# Altium project SAMA7D65-Curiosity.PrjPcb (part 8 of 12)

## Sheet 11 - GMAC1-SODIMM.SchDoc
size B; CompanyName: Microchip Technology Inc.; Organization: Microchip Technology; Address1: 2355 West Chandler Blvd.; Address2: Chandler, AZ  85224; Address4: USA; DocumentNumber: 11; SheetNumber: 11; SheetTotal: 15; SheetTitle: GMAC1 SODIMM
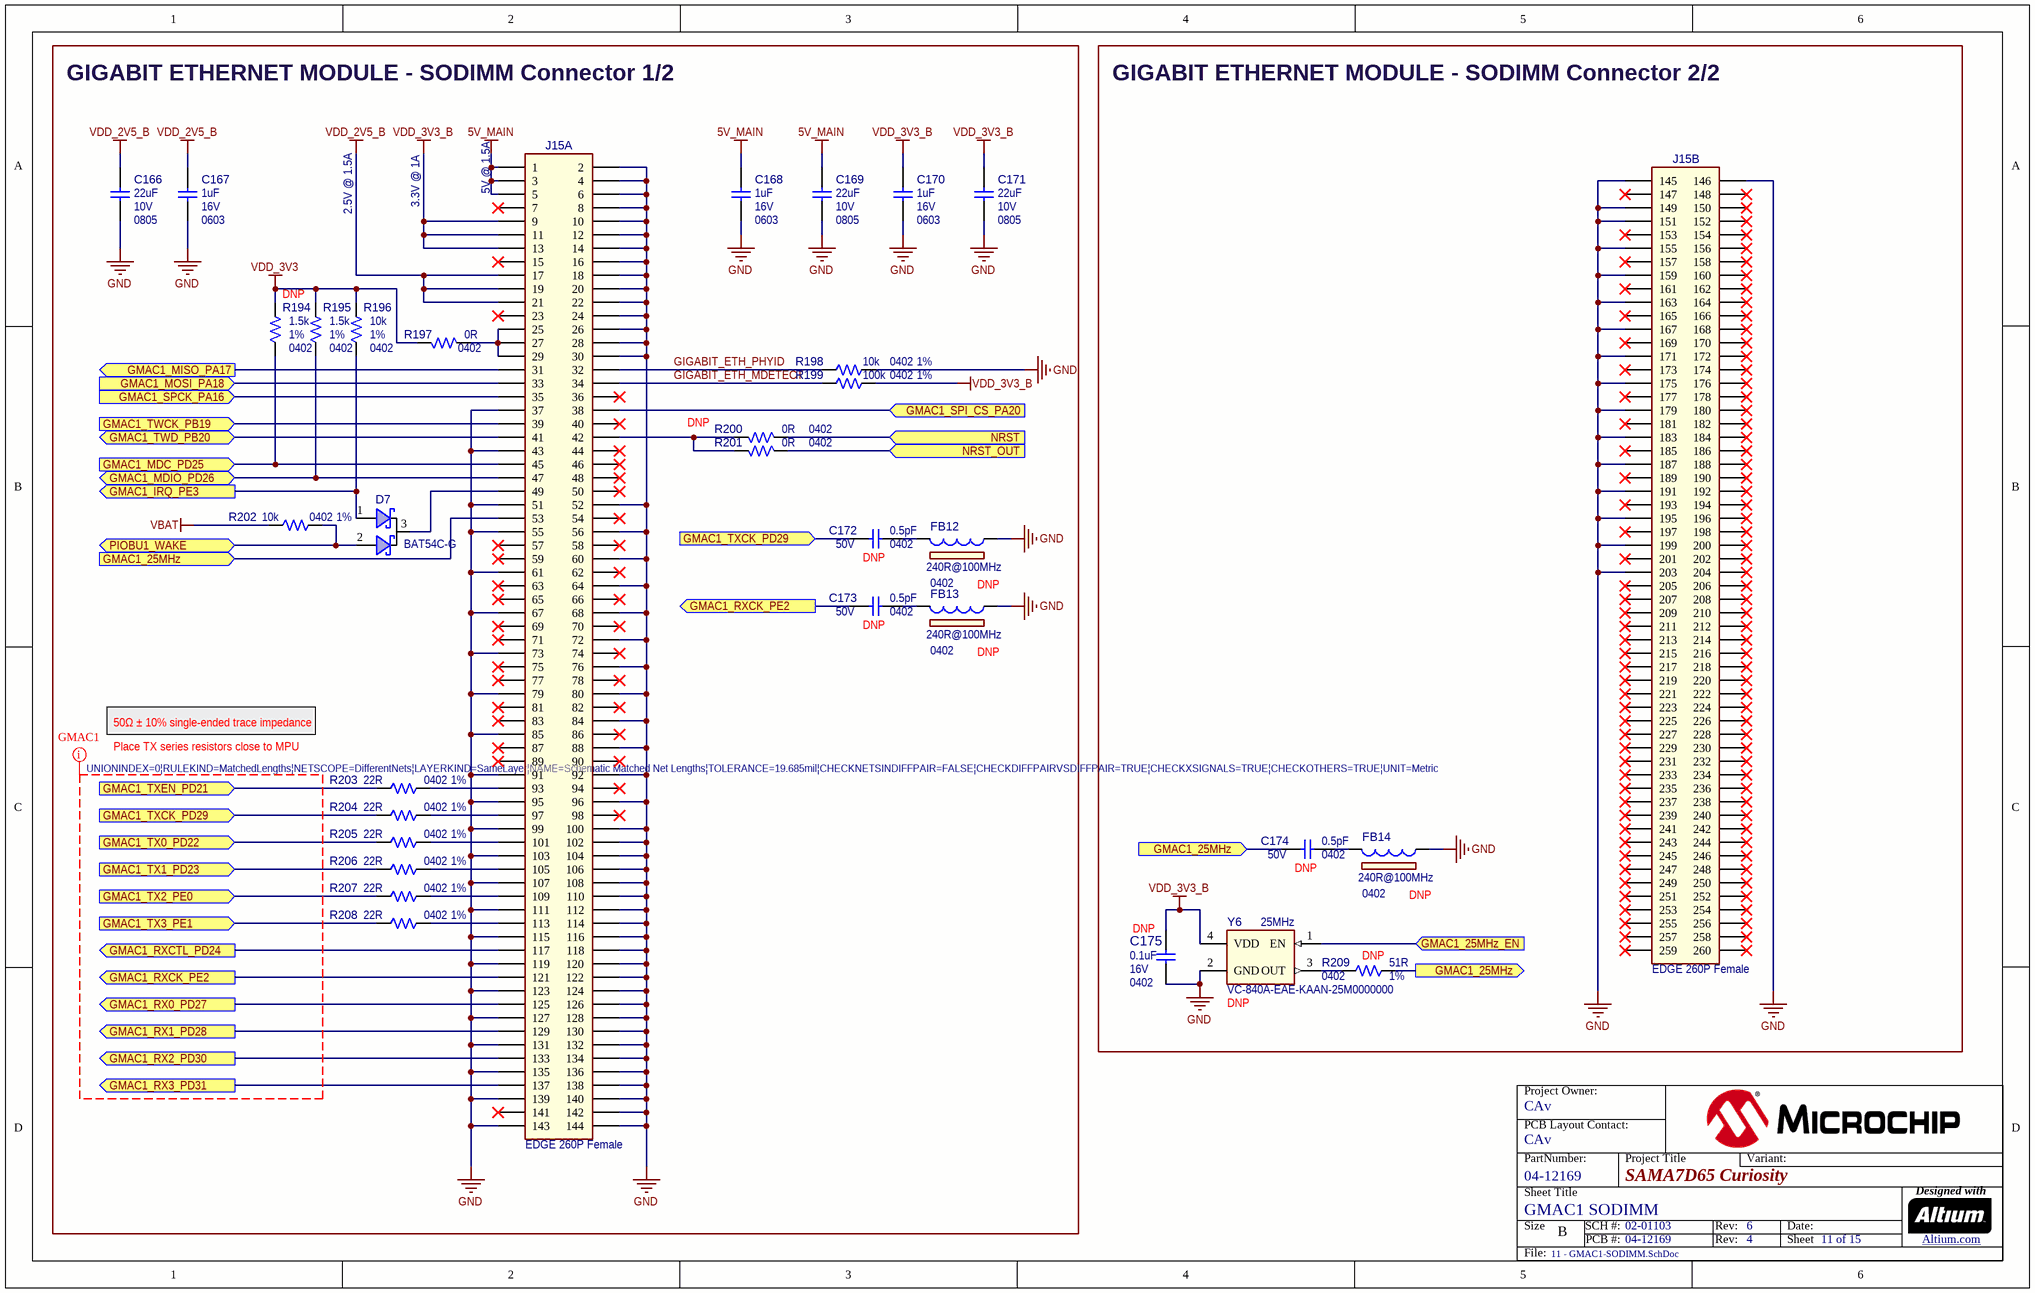
[diagram p10: 11 - GMAC1-SODIMM.SchDoc]

### Parts
C166  value 22uF  Voltage: 10V  Package: 0805  [CAP_C_0805]  (hidden comment: Capacitor NP)
C167  value 1uF  Voltage: 16V  Package: 0603  [CAP_C_0603]  (hidden comment: Capacitor NP)
C168  value 1uF  Voltage: 16V  Package: 0603  [CAP_C_0603]  (hidden comment: Capacitor NP)
C169  value 22uF  Voltage: 10V  Package: 0805  [CAP_C_0805]  (hidden comment: Capacitor NP)
C170  value 1uF  Voltage: 16V  Package: 0603  [CAP_C_0603]  (hidden comment: Capacitor NP)
C171  value 22uF  Voltage: 10V  Package: 0805  [CAP_C_0805]  (hidden comment: Capacitor NP)
C172  value 0.5pF  Voltage: 50V  Package: 0402  Populated: DNP  [CAP_C_0402]  (hidden comment: Capacitor NP)
C173  value 0.5pF  Voltage: 50V  Package: 0402  Populated: DNP  [CAP_C_0402]  (hidden comment: Capacitor NP)
C174  value 0.5pF  Voltage: 50V  Package: 0402  Populated: DNP  [CAP_C_0402]  (hidden comment: Capacitor NP)
C175  value 0.1uF  Voltage: 16V  Package: 0402  Populated: DNP  [CAP_C_0402]  (hidden comment: Capacitor NP)
D7  value BAT54C-G  [SOT-23-3]  (hidden comment: Diode Schottky Dual CK)
FB12  value 240R@100MHz  Package: 0402  Populated: DNP  [IND_C_0402]  (hidden comment: Ferrite Bead)
FB13  value 240R@100MHz  Package: 0402  Populated: DNP  [IND_C_0402]  (hidden comment: Ferrite Bead)
FB14  value 240R@100MHz  Package: 0402  Populated: DNP  [IND_C_0402]  (hidden comment: Ferrite Bead)
J15  value EDGE 260P Female  [CON_EDGE-CARD_DDR4_260P_SODIMM_2309413]  (hidden comment: Header 2x130 EDGE CARD)  (parts A,B of 2)
R194  value 1.5k  Package: 0402  Tolerance: 1%  Populated: DNP  [RES_C_0402]  (hidden comment: Resistor)
R195  value 1.5k  Package: 0402  Tolerance: 1%  [RES_C_0402]  (hidden comment: Resistor)
R196  value 10k  Package: 0402  Tolerance: 1%  [RES_C_0402]  (hidden comment: Resistor)
R197  value 0R  Package: 0402  [RES_C_0402]  (hidden comment: Resistor)
R198  value 10k  Package: 0402  Tolerance: 1%  [RES_C_0402]  (hidden comment: Resistor)
R199  value 100k  Package: 0402  Tolerance: 1%  [RES_C_0402]  (hidden comment: Resistor)
R200  value 0R  Package: 0402  Populated: DNP  [RES_C_0402]  (hidden comment: Resistor)
R201  value 0R  Package: 0402  [RES_C_0402]  (hidden comment: Resistor)
R202  value 10k  Package: 0402  Tolerance: 1%  [RES_C_0402]  (hidden comment: Resistor)
R203  value 22R  Package: 0402  Tolerance: 1%  [RES_C_0402]  (hidden comment: Resistor)
R204  value 22R  Package: 0402  Tolerance: 1%  [RES_C_0402]  (hidden comment: Resistor)
R205  value 22R  Package: 0402  Tolerance: 1%  [RES_C_0402]  (hidden comment: Resistor)
R206  value 22R  Package: 0402  Tolerance: 1%  [RES_C_0402]  (hidden comment: Resistor)
R207  value 22R  Package: 0402  Tolerance: 1%  [RES_C_0402]  (hidden comment: Resistor)
R208  value 22R  Package: 0402  Tolerance: 1%  [RES_C_0402]  (hidden comment: Resistor)
R209  value 51R  Package: 0402  Tolerance: 1%  Populated: DNP  [RES_C_0402]  (hidden comment: Resistor)
Y6  value 25MHz  Manufacturer Part Number 1: VC-840A-EAE-KAAN-25M0000000  Populated: DNP  [CRYSTAL_VC-840]  (hidden comment: OSCILLATOR 4 Pins)

### Blocks framed on the sheet
GIGABIT ETHERNET MODULE - SODIMM Connector 1/2: C166-C173 D7 FB12 FB13 J15 R194-R208
GIGABIT ETHERNET MODULE - SODIMM Connector 2/2: C174 C175 FB14 J15 R209 Y6

### Ports
GMAC1_25MHz (in), GMAC1_25MHz (out), GMAC1_25MHz_EN (in), GMAC1_IRQ_PE3 (out), GMAC1_MDC_PD25 (in), GMAC1_MDIO_PD26 (bidir), GMAC1_MISO_PA17 (out), GMAC1_MOSI_PA18 (in), GMAC1_RX0_PD27 (out), GMAC1_RX1_PD28 (out), GMAC1_RX2_PD30 (out), GMAC1_RX3_PD31 (out), GMAC1_RXCK_PE2 (out), GMAC1_RXCTL_PD24 (out), GMAC1_SPCK_PA16 (in), GMAC1_SPI_CS_PA20 (in), GMAC1_TWCK_PB19 (in), GMAC1_TWD_PB20 (bidir), GMAC1_TX0_PD22 (in), GMAC1_TX1_PD23 (in), GMAC1_TX2_PE0 (in), GMAC1_TX3_PE1 (in), GMAC1_TXCK_PD29 (in), GMAC1_TXEN_PD21 (in), NRST (in), NRST_OUT (in), PIOBU1_WAKE (bidir)

### Nets
5V_MAIN: C168.2 C169.2 J15.1 J15.3 J15.5
GND: C166.1 C167.2 C168.1 C169.1 C170.1 C171.1 C175.1 FB12.1 FB13.1 FB14.1 J15.2 J15.4 J15.6 J15.8 J15.10 J15.12 J15.14 J15.16 J15.18 J15.20 J15.22 J15.24 J15.26 J15.28 J15.30 J15.37 J15.43 J15.51 J15.52 J15.55 J15.56 J15.60 J15.61 J15.64 J15.67 J15.68 J15.72 J15.73 J15.76 J15.79 J15.80 J15.84 J15.85 J15.88 J15.91 J15.92 J15.95 J15.96 J15.99 J15.100 J15.102 J15.103 J15.104 J15.106 J15.107 J15.108 J15.110 J15.111 J15.112 J15.114 J15.115 J15.116 J15.118 J15.119 J15.120 J15.122 J15.123 J15.124 J15.126 J15.127 J15.128 J15.130 J15.131 J15.132 J15.134 J15.135 J15.136 J15.138 J15.139 J15.140 J15.142 J15.143 J15.144 J15.145 J15.146 J15.149 J15.151 J15.155 J15.159 J15.163 J15.167 J15.171 J15.175 J15.179 J15.183 J15.187 J15.191 J15.195 J15.199 J15.203 R198.1 Y6.2(GND)
VBAT: R202.2
VDD_2V5_B: C166.2 C167.1 J15.17 J15.19 J15.21
VDD_3V3: R194.2 R195.2 R196.2 R197.1
VDD_3V3_B: C170.2 C171.2 C175.2 J15.9 J15.11 J15.13 R199.1 Y6.4(VDD)
GIGABIT_ETH_MDETECT: J15.34 R199.2
GIGABIT_ETH_PHYID: J15.32 R198.2
GMAC1_25MHz: C174.2 J15.53 R209.1 ; port GMAC1_25MHz
GMAC1_25MHz_EN: Y6.1(EN) ; port GMAC1_25MHz_EN
GMAC1_IRQ_PE3: D7.1(A) R196.1 ; port GMAC1_IRQ_PE3
GMAC1_MDC_PD25: J15.45 R194.1 ; port GMAC1_MDC_PD25
GMAC1_MDIO_PD26: J15.47 R195.1 ; port GMAC1_MDIO_PD26
GMAC1_MISO_PA17: J15.31 ; port GMAC1_MISO_PA17
GMAC1_MOSI_PA18: J15.33 ; port GMAC1_MOSI_PA18
GMAC1_RX0_PD27: J15.125 ; port GMAC1_RX0_PD27
GMAC1_RX1_PD28: J15.129 ; port GMAC1_RX1_PD28
GMAC1_RX2_PD30: J15.133 ; port GMAC1_RX2_PD30
GMAC1_RX3_PD31: J15.137 ; port GMAC1_RX3_PD31
GMAC1_RXCK_PE2: C173.2 J15.121 ; port GMAC1_RXCK_PE2
GMAC1_RXCTL_PD24: J15.117 ; port GMAC1_RXCTL_PD24
GMAC1_SPCK_PA16: J15.35 ; port GMAC1_SPCK_PA16
GMAC1_SPI_CS_PA20: J15.38 ; port GMAC1_SPI_CS_PA20
GMAC1_TWCK_PB19: J15.39 ; port GMAC1_TWCK_PB19
GMAC1_TWD_PB20: J15.41 ; port GMAC1_TWD_PB20
GMAC1_TX0_PD22: R205.1 ; port GMAC1_TX0_PD22
GMAC1_TX1_PD23: R206.1 ; port GMAC1_TX1_PD23
GMAC1_TX2_PE0: R207.1 ; port GMAC1_TX2_PE0
GMAC1_TX3_PE1: R208.1 ; port GMAC1_TX3_PE1
GMAC1_TXCK_PD29: C172.2 R204.1 ; port GMAC1_TXCK_PD29
GMAC1_TXEN_PD21: R203.1 ; port GMAC1_TXEN_PD21
NRST: R200.2 ; port NRST
nRST_OUT: R201.2 ; port NRST_OUT
PIOBU1_WAKE: D7.2(A) R202.1 ; port PIOBU1_WAKE
NetC172_1: C172.1 FB12.2
NetC173_1: C173.1 FB13.2
NetC174_1: C174.1 FB14.2
NetD7_3: D7.3(KK) J15.49
NetJ15_25: J15.25 J15.27 J15.29 R197.2
NetJ15_42: J15.42 R200.1 R201.1
NetJ15_93: J15.93 R203.2
NetJ15_97: J15.97 R204.2
NetJ15_101: J15.101 R205.2
NetJ15_105: J15.105 R206.2
NetJ15_109: J15.109 R207.2
NetJ15_113: J15.113 R208.2
NetR209_2: R209.2 Y6.3(OUT)

Not connected (* = marked no-connect by the designer): J15 7* 15* 23* 36* 40* 44* 46* 48* 50* 54* 57* 58* 59* 62* 63* 65* 66* 69* 70* 71* 74* 75* 77* 78* 81* 82* 83* 86* 87* 89* 90* 94* 98* 141* 147* 148* 150* 152* 153* 154* 156* 157* 158* 160* 161* 162* 164* 165* 166* 168* 169* 170* 172* 173* 174* 176* 177* 178* 180* 181* 182* 184* 185* 186* 188* 189* 190* 192* 193* 194* 196* 197* 198* 200* 201* 202* 204* 205* 206* 207* 208* 209* 210* 211* 212* 213* 214* 215* 216* 217* 218* 219* 220* 221* 222* 223* 224* 225* 226* 227* 228* 229* 230* 231* 232* 233* 234* 235* 236* 237* 238* 239* 240* 241* 242* 243* 244* 245* 246* 247* 248* 249* 250* 251* 252* 253* 254* 255* 256* 257* 258* 259* 260*

### Layout directives
net class GMAC1; rule Matched Net Lengths [Tolerance = 0.5mm]: (no net found under the mark)

### Notes on the sheet
- 2.5V @ 1.5A
- 3.3V @ 1A
- (near J15) 5V @ 1.5A
- 50Ω ± 10% single-ended trace impedance
- Place TX series resistors close to MPU
- Project Owner:
- PCB Layout Contact:
- PartNumber:
- Project Title
- Variant:
- Sheet Title
- Size
- B
- SCH #:
- PCB #:
- Rev:
- Date:
- Sheet
- Designed with
- Altium.com <http://go.altium.com/MicrochipLandingPage_Evaluation.html>
- File:

### Library data of the parts
C166 C169 C171 = CAP1618: as C131 on sheet 08 - Memories; MCHP-ID: CAP1618; Revision: 3; Symbol: Capacitor NP; Status: MCL Design; ComponentLink1URL: https://chn-vm-apps.microchip.com/mchprepo/parts/Datasheets/mlcc_commercial_general_en.pdf; ComponentLink1Description: SVN Datasheet; ComponentLink2URL: C:\ALTIUM_WORK\00001_MCHP-CDB\Datasheets\mlcc_commercial_general_en.pdf; ComponentLink2Description: Local Datasheet; ComponentLink3URL: C:\ALTIUM_WORK\00001_MCHP-CDB\Library\LibraryRefs\Capacitor NP.SchLib; ComponentLink3Description: Open Symbol; ComponentLink4URL: C:\ALTIUM_WORK\00001_MCHP-CDB\Library\Footprints\CAP_C_0805.PcbLib; ComponentLink4Description: Open Footprint; ComponentLink5Description: Open Footprint 2; ComponentLink6Description: Open Footprint 3; ComponentLink7Description: Open Footprint 4; Operating Temperature: -55C to +125C; Category: Capacitor; Supplier 1: Digi-Key; Supplier Part Number 1: 445-14560-1-ND; Quantity Override: 1
C167 C168 C170 = CAP0265: as C136 on sheet 09 - M.2-SDMMC2; MCHP-ID: CAP0265; Revision: 4; Symbol: Capacitor NP; Status: MCL Design; ComponentLink1URL: https://chn-vm-apps.microchip.com/mchprepo/parts/Datasheets/smccp.pdf; ComponentLink1Description: SVN Datasheet; ComponentLink2URL: C:\ALTIUM_WORK\00001_MCHP-CDB\Datasheets\smccp.pdf; ComponentLink2Description: Local Datasheet; ComponentLink3URL: C:\ALTIUM_WORK\00001_MCHP-CDB\Library\LibraryRefs\Capacitor NP.SchLib; ComponentLink3Description: Open Symbol; ComponentLink4URL: C:\ALTIUM_WORK\00001_MCHP-CDB\Library\Footprints\CAP_C_0603.PcbLib; ComponentLink4Description: Open Footprint; ComponentLink5Description: Open Footprint 2; ComponentLink6Description: Open Footprint 3; ComponentLink7Description: Open Footprint 4; Operating Temperature: -55C to +85C; Category: Capacitor; Manufacturer 2: KEMET; Manufacturer Part Number 2: C0603C105K4PACTU; Manufacturer 3: TDK; Manufacturer Part Number 3: C1608X5R1C105K080AA; Manufacturer 4: Vishay Vitramon; Manufacturer Part Number 4: VJ0603G105KXJCW1BC; Manufacturer 5: Yageo; Manufacturer Part Number 5: CC0603KRX5R7BB105; Supplier 1: Digi-Key; Supplier Part Number 1: 478-1249-1-ND; Supplier 2: Digi-Key; Supplier Part Number 2: 399-5090-1-ND; Supplier 3: Digi-Key; Supplier Part Number 3: 445-1416-1-ND; Supplier 4: Digi-Key; Supplier Part Number 4: 720-1851-1-ND; Supplier 5: Digi-Key; Supplier Part Number 5: 311-1444-1-ND; Quantity Override: 1
C172-C174 = CAP0274: as C126 on sheet 08 - Memories; MCHP-ID: CAP0274; Revision: 2; Symbol: Capacitor NP; Status: MCL Design; ComponentLink1URL: https://chn-vm-apps.microchip.com/mchprepo/parts/Datasheets/MLCC_ordering_code.pdf; ComponentLink1Description: SVN Datasheet; ComponentLink2URL: C:\ALTIUM_WORK\00001_MCHP-CDB\Datasheets\MLCC_ordering_code.pdf; ComponentLink2Description: Local Datasheet; ComponentLink3URL: C:\ALTIUM_WORK\00001_MCHP-CDB\Library\LibraryRefs\Capacitor NP.SchLib; ComponentLink3Description: Open Symbol; ComponentLink4URL: C:\ALTIUM_WORK\00001_MCHP-CDB\Library\Footprints\CAP_C_0402.PcbLib; ComponentLink4Description: Open Footprint; ComponentLink5Description: Open Footprint 2; ComponentLink6Description: Open Footprint 3; ComponentLink7Description: Open Footprint 4; Operating Temperature: -55C to +125C; Category: Capacitor; Manufacturer 2: KYOCERA AVX; Manufacturer Part Number 2: 04025A0R5CAT2A; Manufacturer 3: Yageo; Manufacturer Part Number 3: CC0402CRNPO9BNR50; Supplier 1: Digi-Key; Supplier Part Number 1: 399-1000-2-ND; Supplier 2: Digi-Key; Supplier Part Number 2: 478-1057-2-ND; Supplier 3: Digi-Key; Supplier Part Number 3: 311-1001-2-ND; Quantity Override: 1
C175 = CAP1033: Manufacturer 1: Hottech; Manufacturer Part Number 1: C1005B104K160NT; Description_: CAP CER 0.1uF 16V 10% X7R SMD 0402; Dev Tools Status: Production; Tolerance: 10%; Type: Ceramic; Owner: Sompoch Loboonlert; Temperature Coefficient: X7R; Restricted Sourcing: No; MCHP-ID: CAP1033; Revision: 10; Symbol: Capacitor NP; Status: MCL Design; ComponentLink1URL: https://chn-vm-apps.microchip.com/mchprepo/parts/Datasheets/L0005E.pdf; ComponentLink1Description: SVN Datasheet; ComponentLink2URL: C:\ALTIUM_WORK\00001_MCHP-CDB\Datasheets\L0005E.pdf; ComponentLink2Description: Local Datasheet; ComponentLink3URL: C:\ALTIUM_WORK\00001_MCHP-CDB\Library\LibraryRefs\Capacitor NP.SchLib; ComponentLink3Description: Open Symbol; ComponentLink4URL: C:\ALTIUM_WORK\00001_MCHP-CDB\Library\Footprints\CAP_C_0402.PcbLib; ComponentLink4Description: Open Footprint; ComponentLink5Description: Open Footprint 2; ComponentLink6Description: Open Footprint 3; ComponentLink7Description: Open Footprint 4; Operating Temperature: -55C to +125C; Category: Capacitor; Supplier 1: Hottech; Supplier Part Number 1: C1005B104K160NT; Quantity Override: 1; Manufacturer 2: KEMET; Manufacturer Part Number 2: C0402C104K4RAC7867; Manufacturer 3: Samsung Electro-Mechanics; Manufacturer Part Number 3: CL05B104KO5NNNC; Supplier 2: Digi-Key; Supplier Part Number 2: 399-C0402C104K4RAC7867TR-ND; Supplier 3: Digi-Key; Supplier Part Number 3: 1276-1001-1-ND; Manufacturer 4: Würth Elektronik; Manufacturer Part Number 4: 885012205037; Manufacturer 5: Samsung Electro-Mechanics; Manufacturer Part Number 5: CL05B104KO5NNND; Manufacturer 6: Samsung Electro-Mechanics; Manufacturer Part Number 6: CL05B104KO5NNNO; Manufacturer 7: Yageo; Manufacturer Part Number 7: CC0402KRX7R7BB104; Supplier 4: Digi-Key; Supplier Part Number 4: 732-7532-1-ND; Supplier 5: Mouser; Supplier Part Number 5: 187-CL05B104KO5NNND; Supplier 6: Samsung Electro-Mechanics; Supplier Part Number 6: CL05B104KO5NNNO; Supplier 7: Yageo; Supplier Part Number 7: CC0402KRX7R7BB104
D7 = DIODE1841: as D6 on sheet 09 - M.2-SDMMC2; MCHP-ID: DIODE1841; Revision: 1; Symbol: Diode Schottky Dual CK; Status: MCL Design; Package: SOT-23-3; ComponentLink1URL: https://chn-vm-apps.microchip.com/mchprepo/parts/Datasheets/BAT54.pdf; ComponentLink1Description: SVN Datasheet; ComponentLink2URL: C:\ALTIUM_WORK\00001_MCHP-CDB\Datasheets\BAT54.pdf; ComponentLink2Description: Local Datasheet; ComponentLink3URL: C:\ALTIUM_WORK\00001_MCHP-CDB\Library\LibraryRefs\Diode Schottky Dual CK.SchLib; ComponentLink3Description: Open Symbol; ComponentLink4URL: C:\ALTIUM_WORK\00001_MCHP-CDB\Library\Footprints\SOT-23-3.PcbLib; ComponentLink4Description: Open Footprint; ComponentLink5Description: Open Footprint 2; ComponentLink6Description: Open Footprint 3; ComponentLink7Description: Open Footprint 4; Operating Temperature: -55C to +125C; Category: Diode; Manufacturer Part Number 1: BAT54C-G; Supplier 1: Digi-Key; Supplier Part Number 1: 641-1320-1-ND; Quantity Override: 1
FB12-FB14 = FB1020: as FB4 on sheet 08 - Memories; Revision: 1; Symbol: Ferrite Bead; Status: MCL Design; ComponentLink1URL: https://chn-vm-apps.microchip.com/mchprepo/parts/Datasheets/beads_commercial_signal_mmz1005_en.pdf; ComponentLink1Description: SVN Datasheet; ComponentLink2URL: C:\ALTIUM_WORK\00001_MCHP-CDB\Datasheets\beads_commercial_signal_mmz1005_en.pdf; ComponentLink2Description: Local Datasheet; ComponentLink3URL: C:\ALTIUM_WORK\00001_MCHP-CDB\Library\LibraryRefs\Ferrite Bead.SchLib; ComponentLink3Description: Open Symbol; ComponentLink4URL: C:\ALTIUM_WORK\00001_MCHP-CDB\Library\Footprints\IND_C_0402.PcbLib; ComponentLink4Description: Open Footprint; ComponentLink5Description: Open Footprint 2; ComponentLink6Description: Open Footprint 3; ComponentLink7Description: Open Footprint 4; Operating Temperature: -55°C ~ 125°C; Type: Ferrite Bead; Category: Inductor; Manufacturer 2: TDK Corporation; Manufacturer Part Number 2: MMZ1005Y241CT000; Supplier 1: Digi-Key; Supplier Part Number 1: 445-2153-1-ND; Supplier 2: Mouser; Supplier Part Number 2: 810-MMZ1005Y241CT000; Quantity Override: 1
J15 = CON2227: Manufacturer 1: TE Connectivity; Manufacturer Part Number 1: 2309413-1; Description_: CON EDGE SODIMM 0.050 260P Female SMD R/A; Dev Tools Status: Design; Owner: Sam Charles; Populated: YES; MCHP-ID: CON2227; Revision: 1; Symbol: Header 2x130 EDGE CARD; Status: MCL Design; ComponentLink1URL: https://chn-vm-apps.microchip.com/mchprepo/parts/Datasheets/ENG_CD_2309413_4.pdf; ComponentLink1Description: SVN Datasheet; ComponentLink2URL: C:\ALTIUM_WORK\00001_MCHP-CDB\Datasheets\ENG_CD_2309413_4.pdf; ComponentLink2Description: Local Datasheet; ComponentLink3URL: C:\ALTIUM_WORK\00001_MCHP-CDB\Library\LibraryRefs\Header 2x130 EDGE CARD.SchLib; ComponentLink3Description: Open Symbol; ComponentLink4URL: C:\ALTIUM_WORK\00001_MCHP-CDB\Library\Footprints\CON_EDGE-CARD_DDR4_260P_SODIMM_2309413.PcbLib; ComponentLink4Description: Open Footprint; ComponentLink5Description: Open Footprint 2; ComponentLink6Description: Open Footprint 3; ComponentLink7Description: Open Footprint 4; Type: Edge Card; Category: Connector; Supplier 1: Digi-Key; Supplier Part Number 1: A126764CT-ND; Quantity Override: 1; Assembly Type: SMD
R194 = RES2289: Manufacturer 1: Panasonic; Manufacturer Part Number 1: ERJ-2RKF1501X; Description_: RES TKF 1.5k 1% 1/10W SMD 0402 AEC-Q200; Dev Tools Status: Production; Power: 1/10W; Owner: Gabor Bihari; Temperature Coefficient: 100ppm/C; Restricted Sourcing: No; MCHP-ID: RES2289; Revision: 1; Symbol: Resistor; Status: MCL Design; ComponentLink1URL: https://chn-vm-apps.microchip.com/mchprepo/parts/Datasheets/AOA0000C304.pdf; ComponentLink1Description: SVN Datasheet; ComponentLink2URL: C:\ALTIUM_WORK\00001_MCHP-CDB\Datasheets\AOA0000C304.pdf; ComponentLink2Description: Local Datasheet; ComponentLink3URL: C:\ALTIUM_WORK\00001_MCHP-CDB\Library\LibraryRefs\Resistor.SchLib; ComponentLink3Description: Open Symbol; ComponentLink4URL: C:\ALTIUM_WORK\00001_MCHP-CDB\Library\Footprints\RES_C_0402.PcbLib; ComponentLink4Description: Open Footprint; ComponentLink5Description: Open Footprint 2; ComponentLink6Description: Open Footprint 3; ComponentLink7Description: Open Footprint 4; Operating Temperature: -55°C - 155°C; Category: Resistor; Type: RES SMD; Composition: TKF; Supplier 1: Digi-Key; Supplier Part Number 1: P1.50KLCT-ND; Quantity Override: 1
R195 = RES2289: as R167 on sheet 10 - GMAC0; MCHP-ID: RES2289; Revision: 1; Symbol: Resistor; Status: MCL Design; ComponentLink1URL: https://chn-vm-apps.microchip.com/mchprepo/parts/Datasheets/AOA0000C304.pdf; ComponentLink1Description: SVN Datasheet; ComponentLink2URL: C:\ALTIUM_WORK\00001_MCHP-CDB\Datasheets\AOA0000C304.pdf; ComponentLink2Description: Local Datasheet; ComponentLink3URL: C:\ALTIUM_WORK\00001_MCHP-CDB\Library\LibraryRefs\Resistor.SchLib; ComponentLink3Description: Open Symbol; ComponentLink4URL: C:\ALTIUM_WORK\00001_MCHP-CDB\Library\Footprints\RES_C_0402.PcbLib; ComponentLink4Description: Open Footprint; ComponentLink5Description: Open Footprint 2; ComponentLink6Description: Open Footprint 3; ComponentLink7Description: Open Footprint 4; Operating Temperature: -55°C - 155°C; Category: Resistor; Type: RES SMD; Composition: TKF; Supplier 1: Digi-Key; Supplier Part Number 1: P1.50KLCT-ND; Quantity Override: 1
R196 R198 R202 = RSMT1019: as R138 on sheet 08 - Memories; MCHP-ID: RSMT1019; Revision: 2; Symbol: Resistor; Status: MCL Design; ComponentLink1URL: https://chn-vm-apps.microchip.com/mchprepo/parts/Datasheets/AOA0000CE2.pdf; ComponentLink1Description: SVN Datasheet; ComponentLink2URL: C:\ALTIUM_WORK\00001_MCHP-CDB\Datasheets\AOA0000CE2.pdf; ComponentLink2Description: Local Datasheet; ComponentLink3URL: C:\ALTIUM_WORK\00001_MCHP-CDB\Library\LibraryRefs\Resistor.SchLib; ComponentLink3Description: Open Symbol; ComponentLink4URL: C:\ALTIUM_WORK\00001_MCHP-CDB\Library\Footprints\RES_C_0402.PcbLib; ComponentLink4Description: Open Footprint; ComponentLink5Description: Open Footprint 2; ComponentLink6Description: Open Footprint 3; ComponentLink7Description: Open Footprint 4; Operating Temperature: -55C to +155C; Category: Resistor; Type: RES SMD; Composition: TKF; Supplier 1: Digi-Key; Supplier Part Number 1: P10.0KLCT-ND; Quantity Override: 1
R197 R201 = RSMT1040: as R158 on sheet 09 - M.2-SDMMC2; MCHP-ID: RSMT1040; Revision: 3; Symbol: Resistor; Status: MCL Design; ComponentLink1URL: https://chn-vm-apps.microchip.com/mchprepo/parts/Datasheets/PYu-RC0402_51_RoHS_L_6.pdf; ComponentLink1Description: SVN Datasheet; ComponentLink2URL: C:\ALTIUM_WORK\00001_MCHP-CDB\Datasheets\PYu-RC0402_51_RoHS_L_6.pdf; ComponentLink2Description: Local Datasheet; ComponentLink3URL: C:\ALTIUM_WORK\00001_MCHP-CDB\Library\LibraryRefs\Resistor.SchLib; ComponentLink3Description: Open Symbol; ComponentLink4URL: C:\ALTIUM_WORK\00001_MCHP-CDB\Library\Footprints\RES_C_0402.PcbLib; ComponentLink4Description: Open Footprint; ComponentLink5Description: Open Footprint 2; ComponentLink6Description: Open Footprint 3; ComponentLink7Description: Open Footprint 4; Operating Temperature: -55C to +155C; Category: Resistor; Type: RES SMD; Composition: TKF; Manufacturer 2: Stackpole Electronics Inc; Manufacturer Part Number 2: RMCF0402ZT0R00; Supplier 1: Digi-Key; Supplier Part Number 1: 311-0.0JRCT-ND; Supplier 2: Digi-Key; Supplier Part Number 2: RMCF0402ZT0R00TR-ND; Quantity Override: 1
R199 = RES1011: Manufacturer 1: Panasonic; Manufacturer Part Number 1: ERJ-2RKF1003X; Description_: RES TKF 100k 1% 1/10W SMD 0402 AEC-Q200; Dev Tools Status: Production; Voltage: 50V; Temperature Coefficient: 100ppm/C; Power: 1/10W; Owner: Tad Ahlvers; Populated: YES; MCHP-ID: RES1011; Revision: 3; Symbol: Resistor; Status: MCL Design; ComponentLink1URL: https://chn-vm-apps.microchip.com/mchprepo/parts/Datasheets/AOA0000CE2.pdf; ComponentLink1Description: SVN Datasheet; ComponentLink2URL: C:\ALTIUM_WORK\00001_MCHP-CDB\Datasheets\AOA0000CE2.pdf; ComponentLink2Description: Local Datasheet; ComponentLink3URL: C:\ALTIUM_WORK\00001_MCHP-CDB\Library\LibraryRefs\Resistor.SchLib; ComponentLink3Description: Open Symbol; ComponentLink4URL: C:\ALTIUM_WORK\00001_MCHP-CDB\Library\Footprints\RES_C_0402.PcbLib; ComponentLink4Description: Open Footprint; ComponentLink5Description: Open Footprint 2; ComponentLink6Description: Open Footprint 3; ComponentLink7Description: Open Footprint 4; Operating Temperature: -55C to +125C; Category: Resistor; Type: RES SMD; Composition: TKF; Manufacturer 2: KOA Speer; Manufacturer Part Number 2: RK73H1ETTP1003F; Supplier 1: Digi-Key; Supplier Part Number 1: P100KLCT-ND; Supplier 2: Mouser; Supplier Part Number 2: 660-RK73H1ETTP1003F; Quantity Override: 1
R200 = RSMT1040: as R184 on sheet 10 - GMAC0; MCHP-ID: RSMT1040; Revision: 3; Symbol: Resistor; Status: MCL Design; ComponentLink1URL: https://chn-vm-apps.microchip.com/mchprepo/parts/Datasheets/PYu-RC0402_51_RoHS_L_6.pdf; ComponentLink1Description: SVN Datasheet; ComponentLink2URL: C:\ALTIUM_WORK\00001_MCHP-CDB\Datasheets\PYu-RC0402_51_RoHS_L_6.pdf; ComponentLink2Description: Local Datasheet; ComponentLink3URL: C:\ALTIUM_WORK\00001_MCHP-CDB\Library\LibraryRefs\Resistor.SchLib; ComponentLink3Description: Open Symbol; ComponentLink4URL: C:\ALTIUM_WORK\00001_MCHP-CDB\Library\Footprints\RES_C_0402.PcbLib; ComponentLink4Description: Open Footprint; ComponentLink5Description: Open Footprint 2; ComponentLink6Description: Open Footprint 3; ComponentLink7Description: Open Footprint 4; Operating Temperature: -55C to +155C; Category: Resistor; Type: RES SMD; Composition: TKF; Manufacturer 2: Stackpole Electronics Inc; Manufacturer Part Number 2: RMCF0402ZT0R00; Supplier 1: Digi-Key; Supplier Part Number 1: 311-0.0JRCT-ND; Supplier 2: Digi-Key; Supplier Part Number 2: RMCF0402ZT0R00TR-ND; Quantity Override: 1
R203-R208 = RES1474: Manufacturer 1: Panasonic Electronic Components; Manufacturer Part Number 1: ERJ-2RKF22R0X; Description_: RES TKF 22R 1% 1/20W SMD 0402; Dev Tools Status: Production; Temperature Coeffcient: 100ppm/C; Circuit Type: Isolated; Power: 1/10W; Owner: Mike Ragsdale; Populated: YES; MCHP-ID: RES1474; Revision: 1; Symbol: Resistor; Status: MCL Design; ComponentLink1Description: SVN Datasheet; ComponentLink2Description: Local Datasheet; ComponentLink3URL: C:\ALTIUM_WORK\00001_MCHP-CDB\Library\LibraryRefs\Resistor.SchLib; ComponentLink3Description: Open Symbol; ComponentLink4URL: C:\ALTIUM_WORK\00001_MCHP-CDB\Library\Footprints\RES_C_0402.PcbLib; ComponentLink4Description: Open Footprint; ComponentLink5Description: Open Footprint 2; ComponentLink6Description: Open Footprint 3; ComponentLink7Description: Open Footprint 4; Operating Temperature: -55C to +155C; Category: Resistor; Type: RES SMD; Composition: TKF; Supplier 1: Digi-Key; Supplier Part Number 1: P22.0LCT-ND; Quantity Override: 1
R209 = RSMT1294: Manufacturer 1: Panasonic Electronic Components; Manufacturer Part Number 1: ERJ-PA2F51R0X; Description_: RES TKF 51R 1% 1/5W SMD 0402; Dev Tools Status: Design; Voltage: 50V; Temperature Coeffcient: 100ppm/C; Power: 1/5W; Owner: Dragos Danaila; MCHP-ID: RSMT1294; Revision: 1; Symbol: Resistor; Status: MCL Design; ComponentLink1URL: https://chn-vm-apps.microchip.com/mchprepo/parts/Datasheets/AOA0000C331.pdf; ComponentLink1Description: SVN Datasheet; ComponentLink2URL: C:\ALTIUM_WORK\00001_MCHP-CDB\Datasheets\AOA0000C331.pdf; ComponentLink2Description: Local Datasheet; ComponentLink3URL: C:\ALTIUM_WORK\00001_MCHP-CDB\Library\LibraryRefs\Resistor.SchLib; ComponentLink3Description: Open Symbol; ComponentLink4URL: C:\ALTIUM_WORK\00001_MCHP-CDB\Library\Footprints\RES_C_0402.PcbLib; ComponentLink4Description: Open Footprint; ComponentLink5Description: Open Footprint 2; ComponentLink6Description: Open Footprint 3; ComponentLink7Description: Open Footprint 4; Operating Temperature: -55C to +155C; Category: Resistor; Type: RES SMD; Composition: TKF; Supplier 1: Digikey; Supplier Part Number 1: P124491CT-ND; Quantity Override: 1
Y6 = MIC9809: Manufacturer 1: Microchip Technology; Description_: MCHP CLOCK OSCILLATOR SNGL 25MHz VC-840A-EAE-KAAN-25M0000000 SMD 2.5x2; Dev Tools Status: Production; Owner: Pilar Alcaine; Restricted Sourcing: No; MCHP-ID: MIC9809; Revision: 1; Symbol: OSCILLATOR 4 Pins; Status: MCL Design; ComponentLink1Description: SVN Datasheet; ComponentLink2Description: Local Datasheet; ComponentLink3URL: C:\ALTIUM_WORK\00001_MCHP-CDB\Library\LibraryRefs\OSCILLATOR 4 Pins.SchLib; ComponentLink3Description: Open Symbol; ComponentLink4URL: C:\ALTIUM_WORK\00001_MCHP-CDB\Library\Footprints\CRYSTAL_VC-840.PcbLib; ComponentLink4Description: Open Footprint; ComponentLink5Description: Open Footprint 2; ComponentLink6Description: Open Footprint 3; ComponentLink7Description: Open Footprint 4; Category: MCHP-Clock/Timing; Type: Oscillator; Supplier 1: Microchip Technology; Supplier Part Number 1: VC-840A-EAE-KAAN-25M0000000; Quantity Override: 1; ComponentLink1URL: https://chn-vm-apps.microchip.com/mchprepo/parts/Datasheets/VC-840A-CMOS-Crystal-Oscillator-DS20006760.pdf; ComponentLink2URL: C:\ALTIUM_WORK\00001_MCHP-CDB\Datasheets\VC-840A-CMOS-Crystal-Oscillator-DS20006760.pdf; Operating Temperature: -55C to +125C